# EAGLE schematic nChannel (EAGLE 9.3.0)
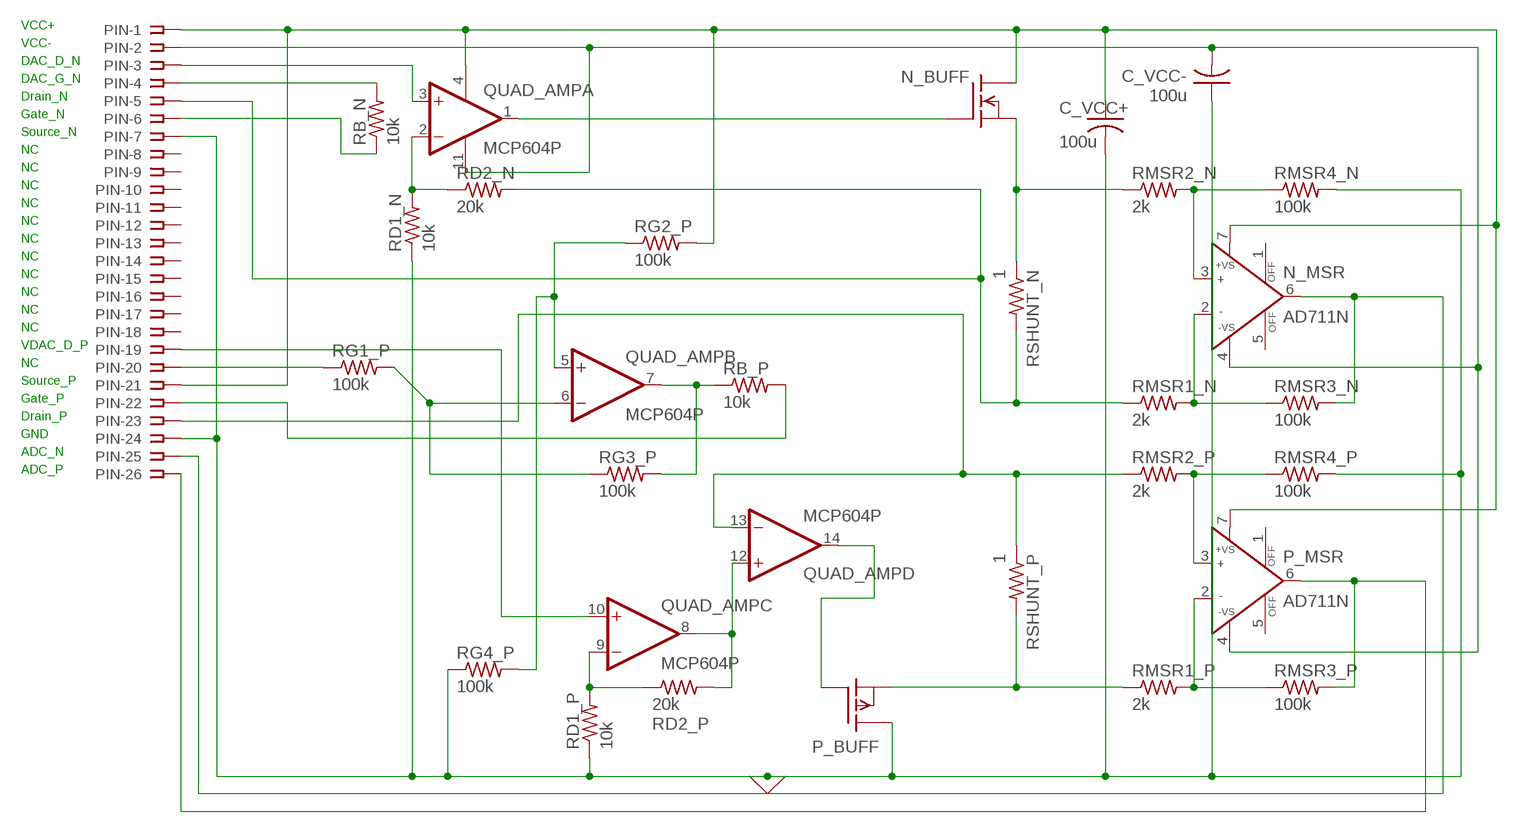
[diagram p0: schematic, sheet 1]

## Parts
C_VCC+  100u  C-US025-024X044  [C025-024X044]
C_VCC-  100u  C-US025-024X044  [C025-024X044]
N_BUFF  BSS101  [TO92]
N_MSR  AD711N  [DIL08]
P_BUFF  BSS110  [TO92]
P_MSR  AD711N  [DIL08]
PIN  SSW-126-02-G-S  [SSW-126-02-G-S]
QUAD_AMP  MCP604P  [DIL14]
RB_N  10k  R-US_0204/5  [0204/5]
RB_P  10k  R-US_0204/5  [0204/5]
RD1_N  10k  R-US_0204/5  [0204/5]
RD1_P  10k  R-US_0204/5  [0204/5]
RD2_N  20k  R-US_0204/5  [0204/5]
RD2_P  20k  R-US_0204/5  [0204/5]
RG1_P  100k  R-US_0204/5  [0204/5]
RG2_P  100k  R-US_0204/5  [0204/5]
RG3_P  100k  R-US_0204/5  [0204/5]
RG4_P  100k  R-US_0204/5  [0204/5]
RMSR1_N  2k  R-US_0204/5  [0204/5]
RMSR1_P  2k  R-US_0204/5  [0204/5]
RMSR2_N  2k  R-US_0204/5  [0204/5]
RMSR2_P  2k  R-US_0204/5  [0204/5]
RMSR3_N  100k  R-US_0204/5  [0204/5]
RMSR3_P  100k  R-US_0204/5  [0204/5]
RMSR4_N  100k  R-US_0204/5  [0204/5]
RMSR4_P  100k  R-US_0204/5  [0204/5]
RSHUNT_N  1  R-US_0204/5  [0204/5]
RSHUNT_P  1  R-US_0204/5  [0204/5]

## Nets
0: C_VCC+.2 C_VCC-.1 P_BUFF.3(D) PIN.7 PIN.24 RD1_N.1 RD1_P.1 RG4_P.1 RMSR4_N.2 RMSR4_P.2 ; supply symbol labelled GND
N$2: PIN.22 RB_P.2
N$3: PIN.20 RG1_P.1
N$5: PIN.3 QUAD_AMP.3(A:+IN)
N$6: N_MSR.3(IN+) RMSR2_N.2 RMSR4_N.1
N$7: N_MSR.2(IN-) RMSR1_N.2 RMSR3_N.1
N$8: N_MSR.6(OUT) PIN.25 RMSR3_N.2
N$13: QUAD_AMP.7(B:OUT) RB_P.1 RG3_P.2
N$15: QUAD_AMP.9(C:-IN) RD1_P.2 RD2_P.1
N$17: PIN.6 RB_N.1
N$18: P_MSR.3(IN+) RMSR2_P.2 RMSR4_P.1
N$19: P_MSR.2(IN-) RMSR1_P.2 RMSR3_P.1
N$20: P_MSR.6(OUT) PIN.26 RMSR3_P.2
N$21: P_BUFF.2(G) QUAD_AMP.14(D:OUT)
N$22: C_VCC-.2 N_MSR.4(-VS) P_MSR.4(-VS) PIN.2 QUAD_AMP.11(P:V-)
N$23: N_BUFF.2(G) QUAD_AMP.1(A:OUT)
N$24: QUAD_AMP.2(A:-IN) RD1_N.2 RD2_N.1
N$25: N_BUFF.1(S) RMSR2_N.1 RSHUNT_N.1
N$26: PIN.5 RD2_N.2 RMSR1_N.1 RSHUNT_N.2
N$27: PIN.4 RB_N.2
N$28: QUAD_AMP.8(C:OUT) QUAD_AMP.12(D:+IN) RD2_P.2
N$29: P_BUFF.1(S) RMSR1_P.1 RSHUNT_P.2
N$31: PIN.23 QUAD_AMP.13(D:-IN) RMSR2_P.1 RSHUNT_P.1
N$32: C_VCC+.1 N_BUFF.3(D) N_MSR.7(+VS) P_MSR.7(+VS) PIN.1 PIN.21 QUAD_AMP.4(P:V+) RG2_P.2
N$33: QUAD_AMP.6(B:-IN) RG1_P.2 RG3_P.1
N$54: QUAD_AMP.5(B:+IN) RG2_P.1 RG4_P.2
RVG_P: PIN.19 QUAD_AMP.10(C:+IN)
Unconnected: N_MSR.1(OFF) N_MSR.5(OFF) P_MSR.1(OFF) P_MSR.5(OFF) PIN.8 PIN.9 PIN.10 PIN.11 PIN.12 PIN.13 PIN.14 PIN.15 PIN.16 PIN.17 PIN.18

## Notes on the sheet
- VCC+
- VCC-
- DAC_D_N
- DAC_G_N
- Drain_N
- Gate_N
- Source_N
- NC
- NC
- NC
- NC
- NC
- NC
- NC
- NC
- NC
- NC
- NC
- VDAC_D_P
- NC
- Source_P
- Gate_P
- Drain_P
- GND
- ADC_N
- ADC_P

## Library data of the parts
C_VCC+ C_VCC- = rcl:C-US: CAPACITOR, American symbol; SPICEPREFIX: C
N_BUFF = transistor-fet:BSS101: N-Channel Enhancement MOSFET 200V; 0,16A; 11Ohm
N_MSR P_MSR = analog-devices:AD711: Precision, Low Cost, High Speed, BiFET Op Amp Source: http://www.analog.com/static/imported-files/data_sheets/AD711.pdf; MPN: AD711BQ; OC_FARNELL: 9604839; OC_NEWARK: 66F5826
P_BUFF = transistor-fet:BSS110: P-Channel Enhancement MOSFET -50V; -0,17A; 6Ohm
PIN = con-samtec:SSW-126-02-G-S: THROUGH-HOLE .025" SQ POST SOCKET Source: Samtec SSW.pdf; MF: Samtec Inc.; MPN: SSW-126-02-G-S; OC_FARNELL: unknown; OC_NEWARK: 11P9742
QUAD_AMP = linear:MCP604: Quad Op Amp 2.7V to 6.0V Single Supply CMOS Source: http://ww1.microchip.com/downloads/en/DeviceDoc/21314g.pdf
RB_N RB_P RD1_N RD1_P RD2_N RD2_P RG1_P RG2_P RG3_P RG4_P RMSR1_N RMSR1_P RMSR2_N RMSR2_P RMSR3_N RMSR3_P RMSR4_N RMSR4_P = rcl:R-US_: RESISTOR, American symbol; SPICEPREFIX: R
RSHUNT_N RSHUNT_P = rcl:R-US_: RESISTOR, American symbol; SPICEPREFIX: 52